# Altium project Guitar_Synth_Pedal_Rev3.PrjPcb (part 2 of 2)

## Sheet MCU IOs.SchDoc: MCU IOs
size A4; SheetNumber: 5; SheetTotal: 6
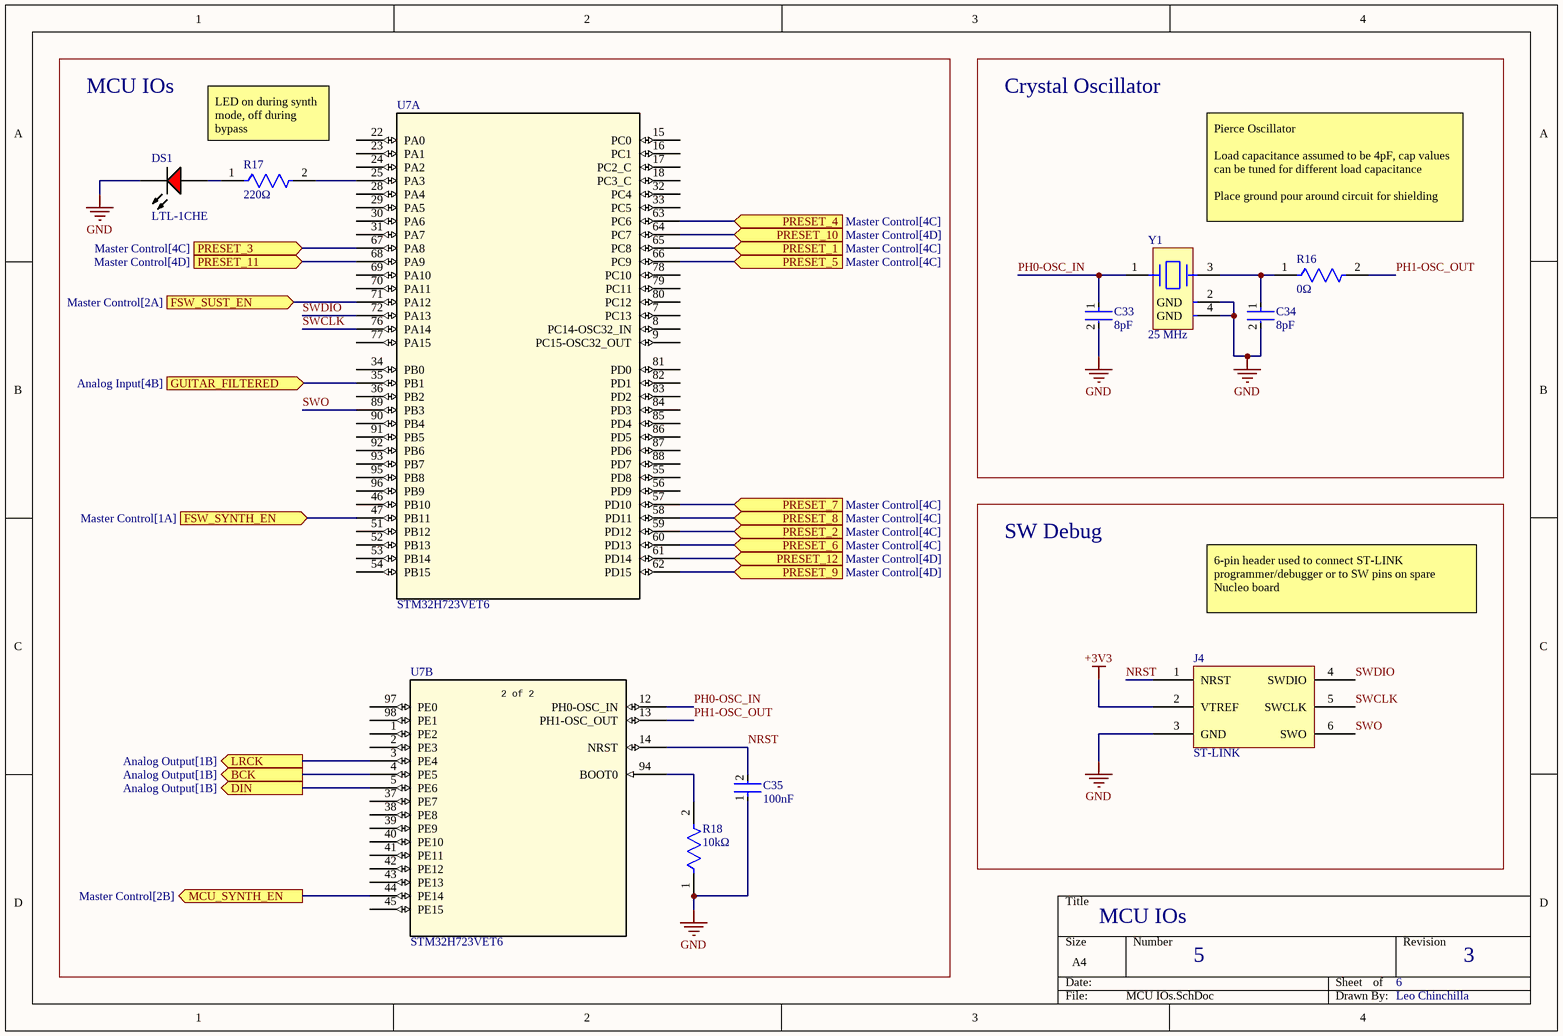
[diagram p6: MCU IOs.SchDoc]

### Parts
(Parts that share a designator on the sheet are numbered #1, #2 ... from top to bottom, then left to right.)
C33  8pF  [FP-CBR06C-MFG]
C34  8pF  [FP-CBR06C-MFG]
C35  100nF  [FP-CC0603-DA-MFG]
DS1  LTL-1CHE  [INDPR60-254-520X380X650]
J4  ST-LINK  [STLINK_Header]
R16#2  0Ω  [FP-CRCW0603-C-MFG]
R17#2  220Ω  [FP-RT0603-MFG]
R18#2  10kΩ  [FP-AT0603-MFG]
U7  STM32H723VET6  [LQFP100_STM]  (parts A,B of 3)
Y1  25 MHz  [ABM8W_MFG]

### Blocks framed on the sheet
MCU IOs: C35 DS1 R17#2 R18#2 U7
Crystal Oscillator: C33 C34 R16#2 Y1
SW Debug: J4

### Ports
BCK (out, see Analog Output[1B]), DIN (out, see Analog Output[1B]), FSW_SUST_EN (in, see Master Control[2A]), FSW_SYNTH_EN (in, see Master Control[1A]), GUITAR_FILTERED (in, see Analog Input[4B]), LRCK (out, see Analog Output[1B]), MCU_SYNTH_EN (out, see Master Control[2B]), PRESET_1 (in, see Master Control[4C]), PRESET_2 (in, see Master Control[4C]), PRESET_3 (in, see Master Control[4C]), PRESET_4 (in, see Master Control[4C]), PRESET_5 (in, see Master Control[4C]), PRESET_6 (in, see Master Control[4C]), PRESET_7 (in, see Master Control[4C]), PRESET_8 (in, see Master Control[4C]), PRESET_9 (in, see Master Control[4D]), PRESET_10 (in, see Master Control[4D]), PRESET_11 (in, see Master Control[4D]), PRESET_12 (in, see Master Control[4D])

### Nets
+3V3: J4.2(VTREF)
GND: C33.2 C34.2 C35.1 DS1.2(K) J4.3(GND) R18#2.1 Y1.2(GND) Y1.4(GND)
NRST: C35.2 J4.1(NRST) U7.14(NRST)
PH0-OSC_IN: C33.1 U7.12(PH0-OSC_IN) Y1.1
PH1-OSC_OUT: R16#2.2 U7.13(PH1-OSC_OUT)
SWCLK: J4.5(SWCLK) U7.76(PA14)
SWDIO: J4.4(SWDIO) U7.72(PA13)
SWO: J4.6(SWO) U7.89(PB3)
NetC6_1: U7.35(PB1) ; port GUITAR_FILTERED
NetC34_1: C34.1 R16#2.1 Y1.3
NetDS1_1: DS1.1(A) R17#2.1
NetJW3_2: U7.47(PB11) ; port FSW_SYNTH_EN
NetJW4_2: U7.71(PA12) ; port FSW_SUST_EN
NetR17#2_2: R17#2.2 U7.25(PA3)
NetR18#2_2: R18#2.2 U7.94(BOOT0)
NetSW3_1: U7.65(PC8) ; port PRESET_1
NetSW3_2: U7.59(PD12) ; port PRESET_2
NetSW3_3: U7.67(PA8) ; port PRESET_3
NetSW3_4: U7.63(PC6) ; port PRESET_4
NetSW3_5: U7.66(PC9) ; port PRESET_5
NetSW3_6: U7.60(PD13) ; port PRESET_6
NetSW3_7: U7.57(PD10) ; port PRESET_7
NetSW3_8: U7.58(PD11) ; port PRESET_8
NetSW3_9: U7.62(PD15) ; port PRESET_9
NetSW3_10: U7.64(PC7) ; port PRESET_10
NetSW3_11: U7.68(PA9) ; port PRESET_11
NetSW3_12: U7.61(PD14) ; port PRESET_12
NetU2_13: U7.4(PE5) ; port BCK
NetU2_14: U7.5(PE6) ; port DIN
NetU2_15: U7.3(PE4) ; port LRCK
NetU5_3: U7.44(PE14) ; port MCU_SYNTH_EN

Not connected (* = marked no-connect by the designer): U7 1(PE2) 2(PE3) 7(PC13) 8(PC14-OSC32_IN) 9(PC15-OSC32_OUT) 15(PC0) 16(PC1) 17(PC2_C) 18(PC3_C) 22(PA0) 23(PA1) 24(PA2) 28(PA4) 29(PA5) 30(PA6) 31(PA7) 32(PC4) 33(PC5) 34(PB0) 36(PB2) 37(PE7) 38(PE8) 39(PE9) 40(PE10) 41(PE11) 42(PE12) 43(PE13) 45(PE15) 46(PB10) 51(PB12) 52(PB13) 53(PB14) 54(PB15) 55(PD8) 56(PD9) 69(PA10) 70(PA11) 77(PA15) 78(PC10) 79(PC11) 80(PC12) 81(PD0) 82(PD1) 83(PD2) 84(PD3) 85(PD4) 86(PD5) 87(PD6) 88(PD7) 90(PB4) 91(PB5) 92(PB6) 93(PB7) 95(PB8) 96(PB9) 97(PE0) 98(PE1)

### Notes on the sheet
- LED on during synth mode, off during bypass
- Pierce Oscillator
  Load capacitance assumed to be 4pF, cap values can be tuned for different load capacitance
  Place ground pour around circuit for shielding
- 6-pin header used to connect ST-LINK programmer/debugger or to SW pins on spare Nucleo board
- (in symbol STM32H723VET6, part B) 2 of 2

### Library data of the parts
C33 C34 = CMP-03020-000447-1: CAP CER 8PF 100V NP0 0603; Manufacturer: KEMET; Manufacturer Part Number: CBR06C809B1GAC; Capacitance: 8.0 pF; Value: 8.0 pF; Temperature Characteristic: C0G; Temperature Coefficient: 30ppm/°C; Material: Ceramic; Tolerance: 0.1 pF; Device Class L1: Passive Components; Digikey Description: CAP CER 8PF 100V NP0 0603; Ipc Land Pattern Name: CAPC16080X80; Octopart: https://octopart.com/cbr06c809b1gac-kemet-23801742; Device Class L3: Ceramic Capacitors; ComponentLink2Description: Datasheet; Voltage Rating: 100 V; RoHS: TRUE; Temperature Range Low: -55°C; Temperature: -55°C to +125°C; Device Class L2: Capacitors; Height: 0.87mm; Temperature Range High: +125°C; ComponentLink2URL: https://content.kemet.com/datasheets/KEM_C1030_CBR_SMD.pdf; Category: Cap; Automotive: No; Lead Free: Yes; Package: CBR06C
C35 = CMP-03422-000081-1: CC0603 100 nF X7R 10.00% 25 V; Manufacturer Part Number: CC0603KPX7R8BB104; Manufacturer: YAGEO; Voltage: 25 V; Material: Ceramic; Tolerance: 0.1; Temperature Coefficient: 15%; Package: CC0603-DA; Capacitance: 100 nF; Device Class L2: Capacitors; Temperature Range High: +125°C; Automotive: No; Temperature Range Low: -55°C; Value: 100 nF; Device Class L1: Passive Components; Height: 0.9mm; RoHS: TRUE; Mouser Description: Multilayer Ceramic Capacitors MLCC - SMD/SMT 100nF 25V X7R 10%; Temperature Characteristic: X7R; Footprint Url: http://www.yageo.com/exep/pages/download/literatures/UPY-C_GEN_24.pdf; Octopart: https://octopart.com/cc0603kpx7r8bb104-yageo-12885111; Category: Cap; ComponentLink2Description: Datasheet; Voltage Rating: 25 V; Temperature: -55°C to +125°C; Device Class L3: Ceramic Capacitors; ComponentLink2URL: http://www.yageo.com/documents/recent/UPY-GPHC_X7R_6.3V-to-50V_18.pdf; Lead Free: Yes
DS1 = CMP-1674-00005-1: Radial LED, 12.6 mcd, 20 mA, 2 V, -55 to 100 degC, 2-Pin THD, RoHS, Bulk; Shielding: Unshielded; Resistance: 0.045 Ohm; Current Rating: 3.6 A; Tolerance: 20%; PackageReference: LTL-1CHE; PackageDescription: 2-Pin Through Hole Device, Dia 3.8 mm, Pitch 2.54 mm; Case\Package: Radial; Length: 0.97 inch; Width: 0.62 inch; Height: 1.1 inch; Radiation Hardening: No; Lead Pitch: 11.44 mm; ComponentLink1URL: http://www.us.liteon.com/; ComponentLink1Description: Manufacturer URL; RoHSCompliant: true; Packaging: Tray; Mount: Through Hole; Min Operating Temperature: -40 degC; Max Operating Temperature: 130 degC; ComponentLink2URL: https://datasheet.ciiva.com/15117/getdatasheetpartid-187746-15117985.pdf; Package Quantity: 55; ComponentLink2Description: Datasheet; DatasheetVersion: Dec-03
R16#2 = CMP-02407-011552-1: RES 0 OHM JUMPER 1/10W 0603; Max Power Dissipation: 100mW; Resistance: 0mR; Min Operating Temperature: -55°C; Packaging: Cut Tape; Resistor Type: Thick Film; RoHS Compliant: Yes; Case/Package: 0603; Case Code (Imperial): 0603; Max Operating Temperature: 155°C; Number of Terminations: 2; Case Code (Metric): 1608
R17#2 = CMP-2000-04526-2: RES SMD 220 OHM 0.1% 1/10W 0603; Manufacturer: Yageo; Manufacturer Part Number: RT0603BRE07220RL; Temperature Coefficient: 50 ppm/°C; Power Rating: 0.1W; Description: RT0603 220Ω 0.1W 50 ppm/°C 0.10%; Voltage Rating: 75V; Tolerance: 0.001; Temperature Range Low: -55°C; Composition: Thin Film; Value: 220Ω; Ipc Land Pattern Name: RESC16080X45; Lead Free: Yes; Temperature: -55°C to +155°C; Automotive: No; Digikey Description: RES SMD 220 OHM 0.1% 1/10W 0603; Series: RT; Package: RT0603; Resistance: 220Ω; Footprint Url: http://www.yageo.com/exep/pages/download/literatures/PYu-R_Mount_10.pdf; Device Class L1: Passive Components; ComponentLink2URL: http://www.yageo.com/documents/recent/PYu-RT_1-to-0.01_RoHS_L_9.pdf; Category: Res; RoHS: TRUE; ComponentLink2Description: Datasheet; Temperature Range High: +155°C; Device Class L3: Chip SMD Resistors; Device Class L2: Resistors; Octopart: https://octopart.com/rt0603bre07220rl-yageo-1214202; Height: 0.55mm
R18#2 = CMP-03412-022275-2: Thin Film Chip Resistors Automotive Grade 10kΩ 0.1% 25ppm/°C 0603; Max Power Dissipation: 100mW; Resistance: 10kR; Min Operating Temperature: -55°C; Ratings: AEC-Q200; Case/Package: 0603; Tolerance: 0.1%; Resistor Type: Thin Film; Max Operating Temperature: 155°C; RoHS Compliant: Yes; Length: 0.063inch; Temperature Coefficient: 25ppm/°C; Packaging: Cut Tape; Number of Terminations: 2; Case Code (Metric): 1608; Case Code (Imperial): 0603; Features: Moisture Resistant; Series: AT; Width: 0.032inch; Height: 0.022inch
U7 = STM32H723VET6: High-performance and DSP with DP-FPU, Arm Cortex-M7 MCU with 512 Kbytes Flash, 564 Kbytes RAM, 550 MHz CPU, L1 cache, external memory interface, subset of peripherals; Manufacturer_Name: STMicroelectronics; Copyright: Copyright (C) 2026 Ultra Librarian. All rights reserved.; Manufacturer_Part_Number: STM32H723VET6; RefDes: RefDes; Type: Type
Y1 = CMP-00005-81936285-1: Crystal 25.0000Mhz 8Pf Smd Rohs Compliant: Yes; RoHS: Compliant; ComponentLink2Description: Datasheet URL; Schedule B: 8541600080; ComponentLink2URL: https://abracon.com/datasheets/ABM8W.pdf; HelpURL: https://abracon.com/datasheets/ABM8W.pdf

## Nets that join several sheets
+3V3: Board Power (C27.1 D3.2 U4.2 U4.4), Analog Input (C1.1 D1.3 R11#1.2 U1.8), Master Control (8 pins), Preset Selection (R9#2.1 SW2#2.1), Analog Output (10 pins), MCU Power (15 pins), MCU IOs (J4.2)
GND: Board Power (11 pins), Analog Input (10 pins), Master Control (10 pins), Preset Selection (C14#1.2 R19#1.2 SW2#2.12), Analog Output (17 pins), MCU Power (20 pins), MCU IOs (8 pins)
NetC6_1: Analog Input (C6.1 R5.2), MCU IOs (U7.35)
NetC20_1: Master Control (R15#1.1), Analog Output (C20.1 R14#2.2)
NetJW3_2: Master Control (JW3.2), MCU IOs (U7.47)
NetJW4_2: Master Control (JW4.2), MCU IOs (U7.71)
NetSW3_1: Master Control (SW3.1), MCU IOs (U7.65)
NetSW3_2: Master Control (SW3.2), MCU IOs (U7.59)
NetSW3_3: Master Control (SW3.3), MCU IOs (U7.67)
NetSW3_4: Master Control (SW3.4), MCU IOs (U7.63)
NetSW3_5: Master Control (SW3.5), MCU IOs (U7.66)
NetSW3_6: Master Control (SW3.6), MCU IOs (U7.60)
NetSW3_7: Master Control (SW3.7), MCU IOs (U7.57)
NetSW3_8: Master Control (SW3.8), MCU IOs (U7.58)
NetSW3_9: Master Control (SW3.9), MCU IOs (U7.62)
NetSW3_10: Master Control (SW3.10), MCU IOs (U7.64)
NetSW3_11: Master Control (SW3.11), MCU IOs (U7.68)
NetSW3_12: Master Control (SW3.12), MCU IOs (U7.61)
NetU2_13: Analog Output (U2.13), MCU IOs (U7.4)
NetU2_14: Analog Output (U2.14), MCU IOs (U7.5)
NetU2_15: Analog Output (U2.15), MCU IOs (U7.3)
NetU5_3: Master Control (U5.3), MCU IOs (U7.44)
PEDAL_IN: Analog Input (C7.1 R13#1.1), Master Control (J2.2 U5.1)